# EAGLE design fact-atmega8 (EAGLE 6.3)
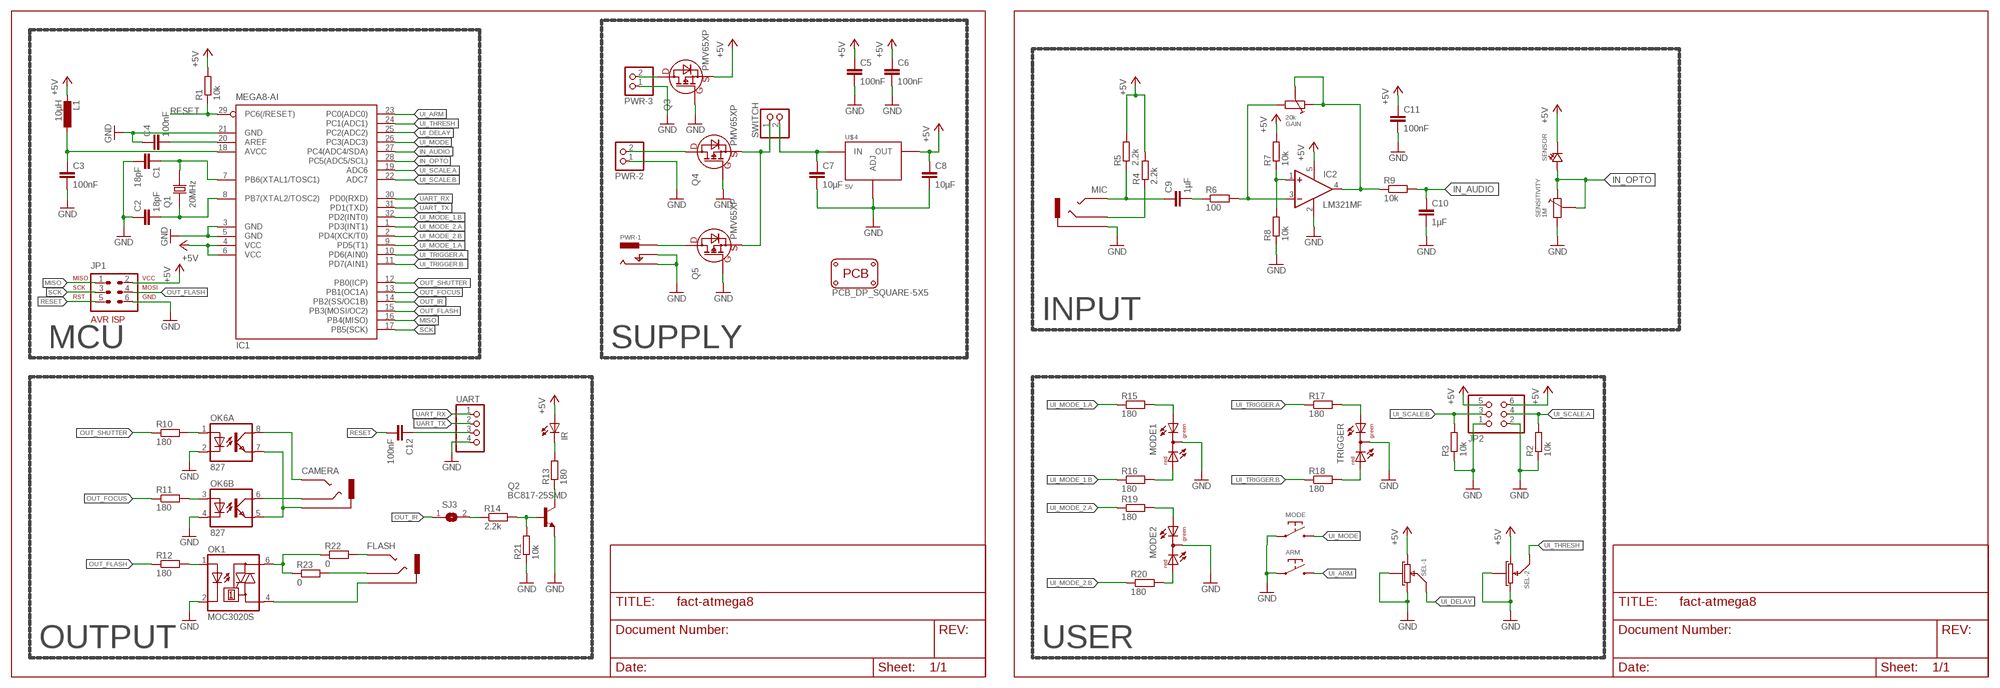
[diagram p0: schematic, sheet 1]

## Parts
ARM  SWITCH-DEFAULT_OFF  [SWITCH-GENERIC-4_PIN]
C1  18pF  C-EUC0603  [C0603]
C2  18pF  C-EUC0603  [C0603]
C3  100nF  C-EUC0603  [C0603]
C4  100nF  C-EUC0603  [C0603]
C5  100nF  C-EUC0603  [C0603]
C6  100nF  C-EUC0603  [C0603]
C7  10µF  C-EUC0603  [C0603]
C8  10µF  C-EUC0603  [C0603]
C9  1µF  C-EUC0603  [C0603]
C10  1µF  C-EUC0603  [C0603]
C11  100nF  C-EUC0603  [C0603]
C12  100nF  C-EUC0603  [C0603]
CAMERA  AUDIO-STEREO2MM5  [AUDIO-STEREO-2MM5-SJ1-2503A]
FLASH  AUDIO-STEREOCONRAD  [AUDIO-STEREO-CONRAD-KB3-3_PIN]
GAIN  20k  TRIM-POT  [TRIM-POT-CA6-VS5]
IC1  MEGA8-AI  [TQFP32-08]
IC2  LM321MF  [SOT23-5]
IR  LED5MM  [LED5MM]
JP1  AVR-ISP-6VERT  [AVR-ISP-6]
JP2  PINHD-2X3  [2X03]
L1  10µH  INDUCTOR0805  [R0805]
MIC  AUDIO-STEREOCONRAD-KB3  [AUDIO-STEREO-CONRAD-KB3-3_PIN]
MODE  SWITCH-DEFAULT_OFF  [SWITCH-GENERIC-4_PIN]
MODE1  DUOLED-RG-C  [DUOLED-C-5MM]
MODE2  DUOLED-RG-C  [DUOLED-C-5MM]
OK1  MOC3020S  MOC3032S  [DIL6-SMD]
OK6  827  OPTOCOUPLER-PC827SMD  [SMD08]
PCB1  PCB_DP_SQUARE-5X5  [DP5050_V1]
PWR-1  POWER-BARREL_JACKPJ-102A  [POWER-BARREL-2MM1-PJ_102A]
PWR-2  PINHD-1X2  [1X02]
PWR-3  PINHD-1X2  [1X02]
Q1  20MHz  CRYSTAL  [CRYSTAL-SMD-5MM_X_3.2MM]
Q2  BC817-25SMD  [SOT23-BEC]
Q3  PMV65XP  FET-P  [SOT23]
Q4  PMV65XP  FET-P  [SOT23]
Q5  PMV65XP  FET-P  [SOT23]
R1  10k  R-EU_R0603  [R0603]
R2  10k  R-EU_R0603  [R0603]
R3  10k  R-EU_R0603  [R0603]
R4  2.2k  R-EU_R0603  [R0603]
R5  2.2k  R-EU_R0603  [R0603]
R6  100  R-EU_R0603  [R0603]
R7  10k  R-EU_R0603  [R0603]
R8  10k  R-EU_R0603  [R0603]
R9  10k  R-EU_R0603  [R0603]
R10  180  R-EU_R0603  [R0603]
R11  180  R-EU_R0603  [R0603]
R12  180  R-EU_R0603  [R0603]
R13  180  R-EU_R0603  [R0603]
R14  2.2k  R-EU_R0603  [R0603]
R15  180  R-EU_R0603  [R0603]
R16  180  R-EU_R0603  [R0603]
R17  180  R-EU_R0603  [R0603]
R18  180  R-EU_R0603  [R0603]
R19  180  R-EU_R0603  [R0603]
R20  180  R-EU_R0603  [R0603]
R21  10k  R-EU_R0603  [R0603]
R22  0  R-EU_R1206  [R1206]
R23  0  R-EU_R1206  [R1206]
SEL  DUAL-POT  [POT-DUAL-P090]
SENSITIVITY  1M  TRIM-POT  [TRIM-POT-CA6-VS5]
SENSOR  PHOTODIODE  [LED-5MM]
SJ3  SJ  [SJ]
SWITCH  PINHD-1X2  [1X02]
TRIGGER  DUOLED-RG-C  [DUOLED-C-5MM]
U$4  5V  REGULATOR-TLV1117SOT223  [SOT223]
UART  PINHD-1X4  [1X04]

## Nets
+5V: C5.1 C6.1 C8.1 C11.1 IC1.4(VCC) IC1.6(VCC) IC2.5(V+) IR.A JP1.2 JP2.5 JP2.6 L1.2 Q3.P$2(SOURCE) R1.2 R4.2 R5.2 R7.2 SEL.P1-3(-1:B) SEL.P2-1(-2:A) SENSOR.K(C) U$4.2(OUT)
GND: ARM.P$1 ARM.P$2 C1.2 C2.1 C3.2 C4.1 C5.2 C6.2 C7.2 C8.2 C10.2 C11.2 IC1.3(GND) IC1.5(GND) IC1.21(GND) IC2.2(V-) JP1.6 JP2.1 JP2.2 MIC.2.1(SLEEVE) MIC.2.2(SLEEVE) MODE1.C MODE2.C MODE.P$1 MODE.P$2 OK1.2(C) OK6.2(A:C) OK6.4(B:C) PWR-1.P$2(OUTER) PWR-1.P$3(SWITCH) PWR-2.1 PWR-3.1 Q2.E Q3.P$1(GATE) Q4.P$1(GATE) Q5.P$1(GATE) R2.1 R3.1 R8.1 R21.1 SEL.CENTER(-1:SHIELD) SEL.G1-S(-1:SHIELD) SEL.G2-S(-2:SHIELD) SEL.P1-1(-1:A) SEL.P2-3(-2:B) SENSITIVITY.P$2 TRIGGER.C U$4.1(ADJ) U$4.4(ADJ) UART.4
HV_OUT: OK1.6(A2) R22.1 R23.1
HV_RING: FLASH.2.1(RING) FLASH.2.2(RING) R23.2
HV_SLEEVE: FLASH.1(SLEEVE) OK1.4(A1)
HV_TIP: FLASH.3(TIP) R22.2
IN_AUDIO: C10.1 IC1.27(PC4(ADC4/SDA)) R9.2
IN_OPTO: IC1.28(PC5(ADC5/SCL)) SENSITIVITY.CENTER SENSITIVITY.P$1 SENSOR.A
MISO: IC1.16(PB4(MISO)) JP1.1
N$1: R14.1 SJ3.2
N$2: C7.1 SWITCH.2 U$4.3(IN)
N$3: C3.1 IC1.18(AVCC) L1.1
N$4: C4.2 IC1.20(AREF)
N$5: PWR-1.P$1(CENTER) Q5.P$3(DRAIN)
N$7: C1.1 IC1.7(PB6(XTAL1/TOSC1)) Q1.P$2(C2)
N$8: C2.2 IC1.8(PB7(XTAL2/TOSC2)) Q1.P$1(C1)
N$9: PWR-2.2 Q4.P$3(DRAIN)
N$11: Q4.P$2(SOURCE) Q5.P$2(SOURCE) SWITCH.1
N$13: PWR-3.2 Q3.P$3(DRAIN)
N$15: CAMERA.P$1(SLEEVE) OK6.5(B:EMIT) OK6.7(A:EMIT)
N$16: CAMERA.P$4(RING) OK6.6(B:COL)
N$17: CAMERA.P$2(TIP) CAMERA.P$3(TIP) OK6.8(A:COL)
N$18: OK6.1(A:A) R10.2
N$19: MIC.1(RING) R4.1
N$20: C9.1 MIC.3(TIP) R5.1
N$21: IC2.1(+IN) R7.1 R8.2
N$22: C9.2 R6.1
N$23: GAIN.P$2 IC2.3(-IN) R6.2
N$24: GAIN.CENTER GAIN.P$1 IC2.4(OUT) R9.1
N$25: OK1.1(A) R12.2
N$26: OK6.3(B:A) R11.2
N$27: Q2.C R13.1
N$28: IR.K(C) R13.2
N$29: Q2.B R14.2 R21.2
N$30: MODE1.AX(AG) R15.2
N$31: MODE1.AR R16.2
N$32: R17.2 TRIGGER.AX(AG)
N$33: R18.2 TRIGGER.AR
N$35: C12.1 UART.3
N$37: MODE2.AX(AG) R19.2
N$38: MODE2.AR R20.2
OUT_FLASH: IC1.15(PB3(MOSI/OC2)) JP1.4 R12.1
OUT_FOCUS: IC1.13(PB1(OC1A)) R11.1
OUT_IR: IC1.14(PB2(SS/OC1B)) SJ3.1
OUT_SHUTTER: IC1.12(PB0(ICP)) R10.1
RESET: C12.2 IC1.29(PC6(/RESET)) JP1.5 R1.1
SCK: IC1.17(PB5(SCK)) JP1.3
UART_RX: IC1.30(PD0(RXD)) UART.1
UART_TX: IC1.31(PD1(TXD)) UART.2
UI_ARM: ARM.P$3 ARM.P$4 IC1.23(PC0(ADC0))
UI_DELAY: IC1.25(PC2(ADC2)) SEL.P1-2(-1:M)
UI_MODE: IC1.26(PC3(ADC3)) MODE.P$3 MODE.P$4
UI_MODE_1.A: IC1.9(PD5(T1)) R15.1
UI_MODE_1.B: IC1.32(PD2(INT0)) R16.1
UI_MODE_2.A: IC1.1(PD3(INT1)) R19.1
UI_MODE_2.B: IC1.2(PD4(XCK/T0)) R20.1
UI_SCALE.A: IC1.19(ADC6) JP2.4 R2.2
UI_SCALE.B: IC1.22(ADC7) JP2.3 R3.2
UI_THRESH: IC1.24(PC1(ADC1)) SEL.P2-2(-2:M)
UI_TRIGGER.A: IC1.10(PD6(AIN0)) R17.1
UI_TRIGGER.B: IC1.11(PD7(AIN1)) R18.1

## Notes on the sheet
- INPUT
- MCU | SUPPLY
- OUTPUT | USER

## Library data of the parts
ARM MODE = p.peter-passives:SWITCH-DEFAULT_OFF
C1-C12 = p.peter-rcl:C-EU: CAPACITOR, European symbol
CAMERA = p.peter-connectors:AUDIO-STEREO: Conrad 3.5mm Stereo 0.66EUR Best.-Nr.: 733962 - 62; OC_DIGIKEY: CP1-2503A-ND
FLASH MIC = p.peter-connectors:AUDIO-STEREO: Conrad 3.5mm Stereo 0.66EUR Best.-Nr.: 733962 - 62; OC_CONRAD: 733962 - 62
GAIN SENSITIVITY = p.peter-passives:TRIM-POT
IC1 = atmel:MEGA8: MICROCONTROLLER 8 Kbytes FLASH, 1 kbytes SRAM, 512 bytes EEPROM, USART, 6-channel 10 bit ADC, 2-channel 8 bit ADC Pin compatible with Atmega48, ATMega88, ATMega168 Source: avr.lbr; MPN: ATMEGA8-16AU; OC_FARNELL: 9171371; OC_NEWARK: 73M8863
IC2 = linear:LM321?*: Low Power Single Op Amp Source: http://cache.national.com/ds/LM/LM321.pdf
IR = led:LED: LED OSRAM: - CHIPLED LG R971, LG N971, LY N971, LG Q971, LY Q971, LO R971, LY R971 LH N974, LH R974 LS Q976, LO Q976, LY Q976 LO Q996 - Hyper CHIPLED LW Q18S LB Q993, LB Q99A, LB R99A - SideLED LS A670, LO A670, LY A670, LG A670, LP A670 LB A673, LV A673, LT A673, LW A673 LH A674 LY A675 LS A676, LA A676, LO A676, LY A676, LW A676 LS A679, LY A679, LG A679 - Hyper Micro SIDELED® LS Y876, LA Y876, LO Y876, LY Y876 LT Y87S - SmartLED LW L88C, LW L88S LB L89C, LB L89S, LG L890 LS L89K, LO L89K, LY L89K LS L896, LA L896, LO L896, LY L896 - TOPLED LS T670, LO T670, LY T670, LG T670, LP T670 LSG T670, LSP T670, LSY T670, LOP T670, LYG T670 LG T671, LOG T671, LSG T671 LB T673, LV T673, LT T673, LW T673 LH T674 LS T676, LA T676, LO T676, LY T676, LB T676, LH T676, LSB T676, LW T676 LB T67C, LV T67C, LT T67C, LS T67K, LO T67K, LY T67K, LW E67C LS E67B, LA E67B, LO E67B, LY E67B, LB E67C, LV E67C, LT E67C LW T67C LS T679, LY T679, LG T679 LS T770, LO T770, LY T770, LG T770, LP T770 LB T773, LV T773, LT T773, LW T773 LH T774 LS E675, LA E675, LY E675, LS T675 LS T776, LA T776, LO T776, LY T776, LB T776 LHGB T686 LT T68C, LB T68C - Hyper Mini TOPLED® LB M676 - Mini TOPLED Santana® LG M470 LS M47K, LO M47K, LY M47K Source: http://www.osram.convergy.de LUXEON: - LUMILED® LXK2-PW12-R00, LXK2-PW12-S00, LXK2-PW14-U00, LXK2-PW14-V00 LXK2-PM12-R00, LXK2-PM12-S00, LXK2-PM14-U00 LXK2-PE12-Q00, LXK2-PE12-R00, LXK2-PE12-S00, LXK2-PE14-T00, LXK2-PE14-U00 LXK2-PB12-K00, LXK2-PB12-L00, LXK2-PB12-M00, LXK2-PB14-N00, LXK2-PB14-P00, LXK2-PB14-Q00 LXK2-PR12-L00, LXK2-PR12-M00, LXK2-PR14-Q00, LXK2-PR14-R00 LXK2-PD12-Q00, LXK2-PD12-R00, LXK2-PD12-S00 LXK2-PH12-R00, LXK2-PH12-S00 LXK2-PL12-P00, LXK2-PL12-Q00, LXK2-PL12-R00 Source: www.luxeon.com KINGBRIGHT: KA-3528ASYC Source: www.kingbright.com
JP1 = avr:AVR-ISP-6: AVR ISP-6 Serial Programming Header
JP2 = pinhead:PINHD-2X3: PIN HEADER
L1 = p.peter-passives:INDUCTOR
MODE1 MODE2 TRIGGER = led:DUOLED-RG-C: DUO LED 2 colors (red/green), 5 mm, round, common Cathode www.ligitek.com or other producers.; OC_DIGIKEY: WP59EGC
OK1 = optocoupler:MOC30*: 6-Pin DIP Zero-Cross Optoisolators Triac Driver Output (250/400 Volt Peak) Source: http://www.fairchildsemi.com/ds/MO/MOC3043-M.pdf; MF: FAIRCHILD SEMICONDUCTOR; MPN: MOC3032S-M; OC_FARNELL: unknown; OC_NEWARK: 05C2871
OK6 = p.peter-ics:OPTOCOUPLER-PC827: SHARP OPTO COUPLER
PCB1 = dp_pcb:PCB_DP_SQUARE: Dangerous Prototypes Standard Square PCB sizes
PWR-1 = p.peter-connectors:POWER-BARREL_JACK
PWR-2 PWR-3 SWITCH = pinhead:PINHD-1X2: PIN HEADER
Q1 = p.peter-ics:CRYSTAL; OC_DIGIKEY: 7A-16.000MAAJ-T
Q2 = transistor-npn:BC817*: NPN Transistor; OC_DIGIKEY: BC817-25LT3GOSCT-ND
Q3-Q5 = p.peter-ics:FET-P
R1-R21 = p.peter-rcl:R-EU_: RESISTOR, European symbol
R22 R23 = rcl:R-EU_: RESISTOR, European symbol
SEL = p.peter-passives:DUAL-POT
SENSOR = p.peter-leds:PHOTODIODE
SJ3 = jumper:SJ: SMD solder JUMPER
U$4 = p.peter-regulators:REGULATOR-TLV1117
UART = pinhead:PINHD-1X4: PIN HEADER

## Board
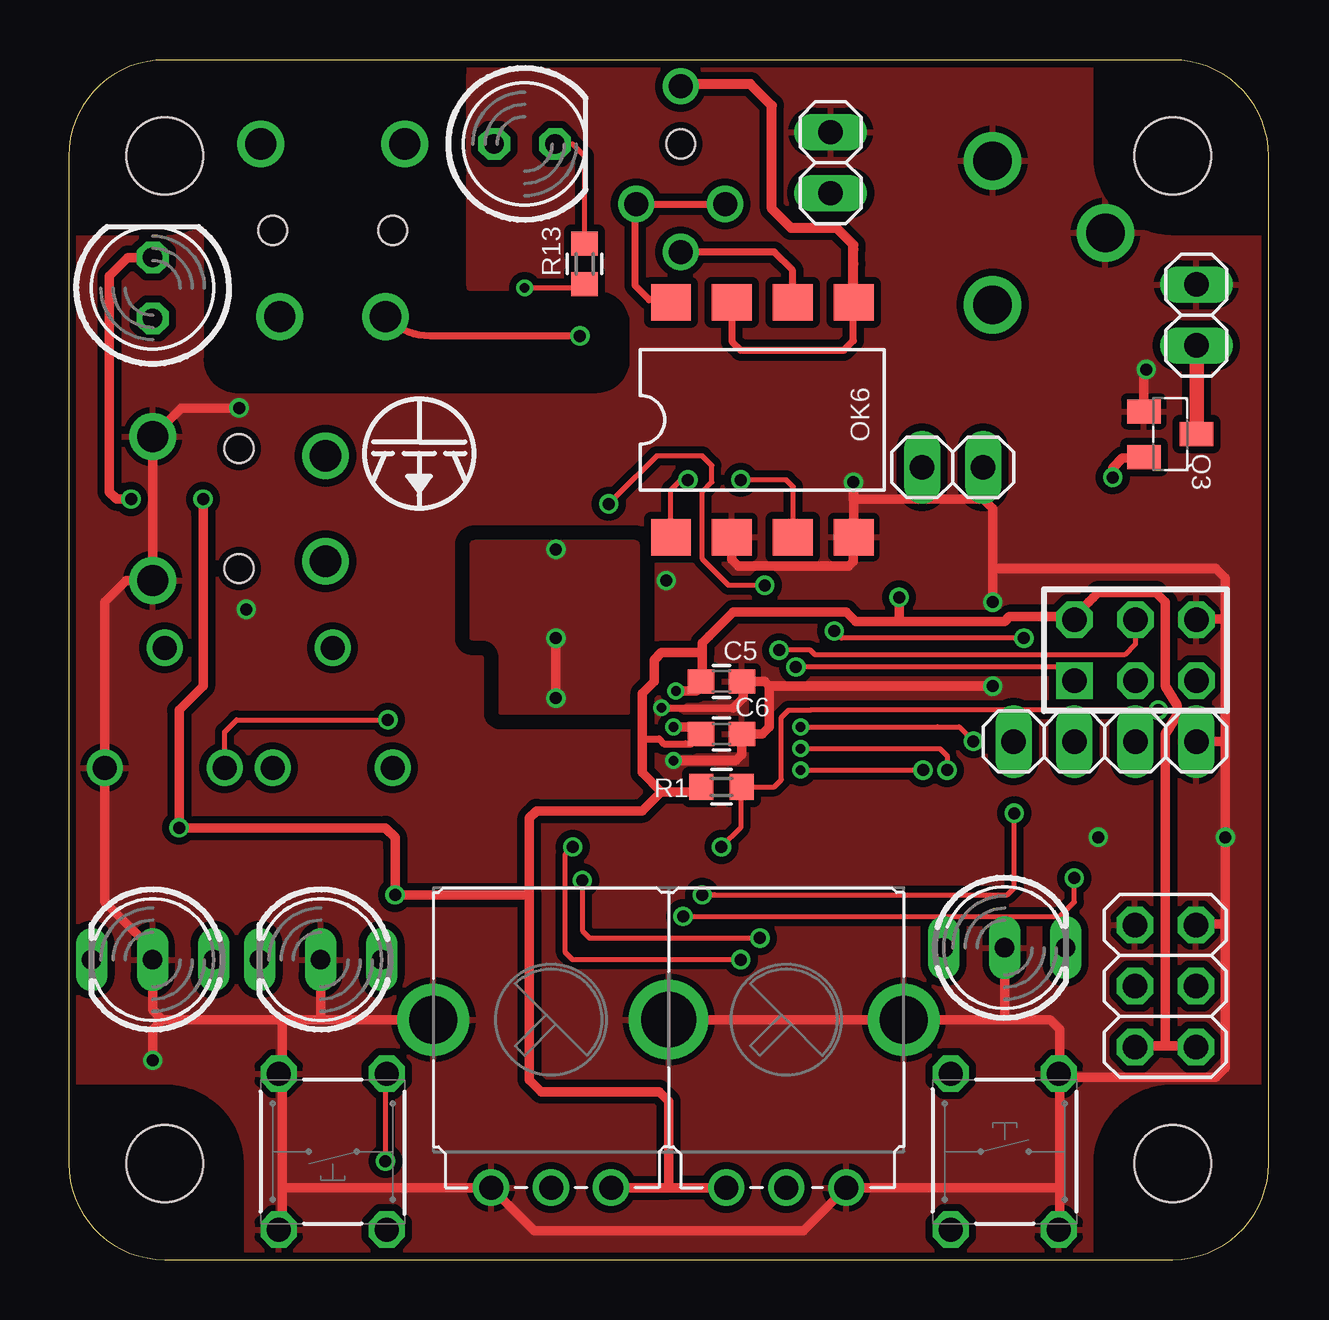
[diagram p1: board, top side]
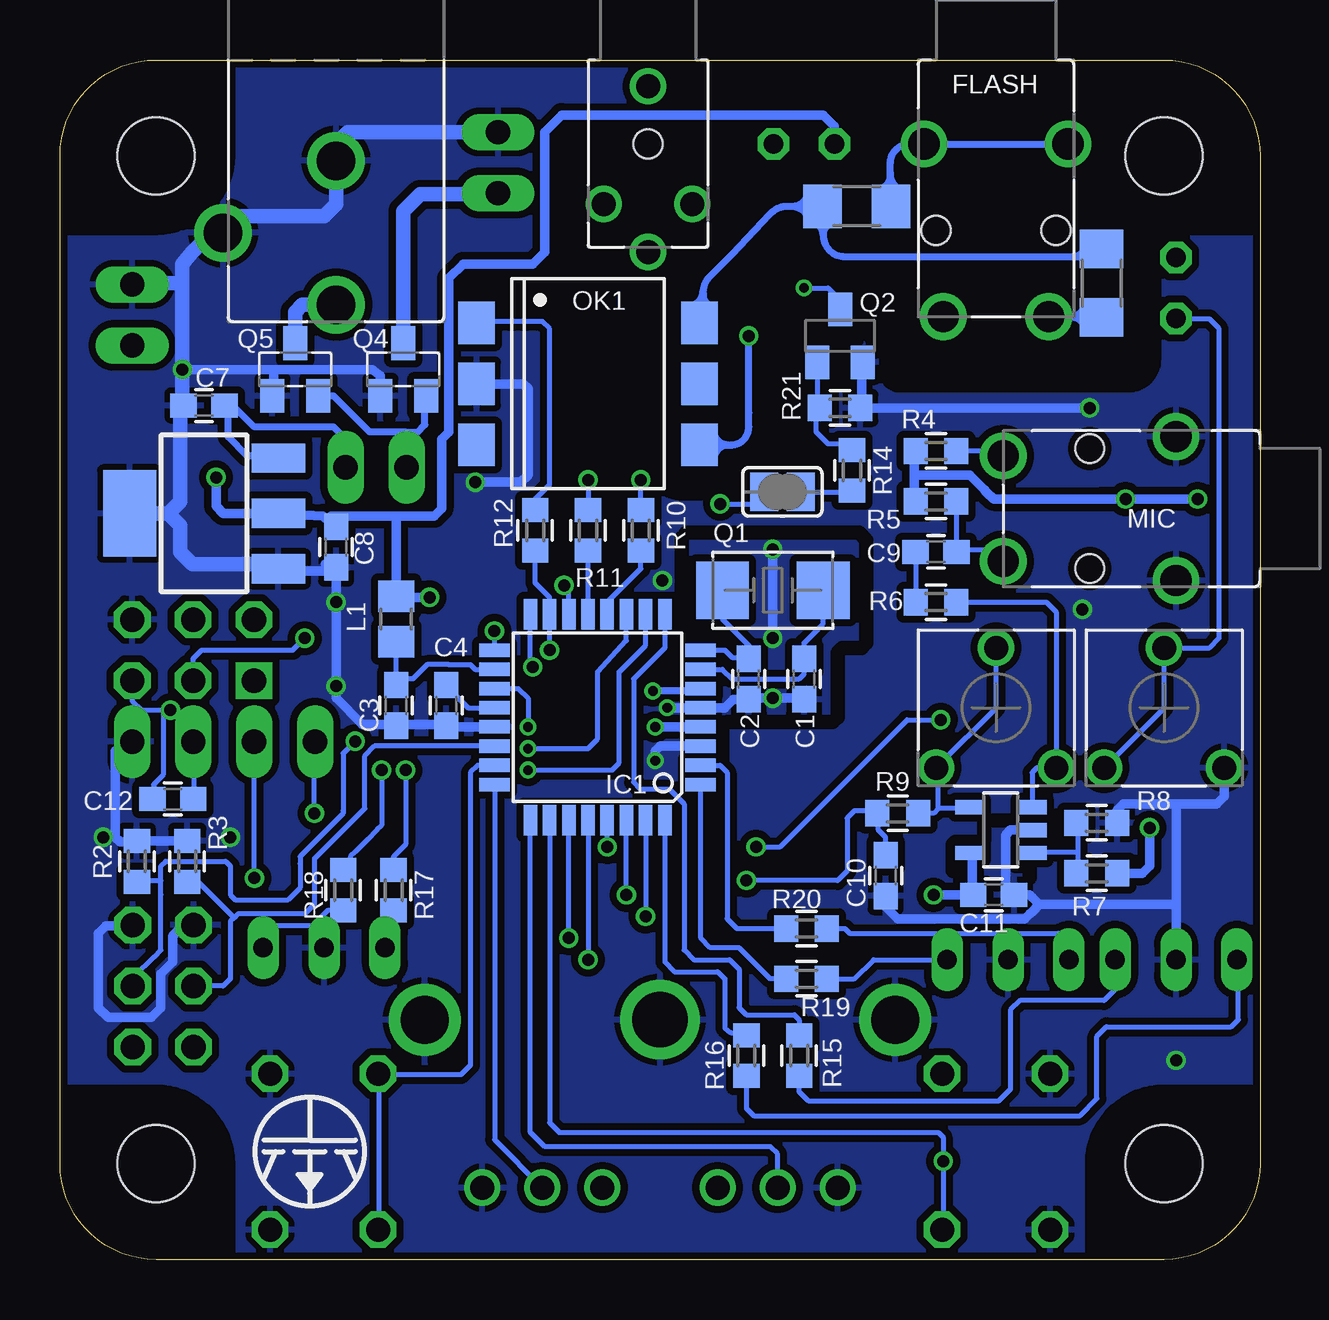
[diagram p2: board, bottom side, seen from below]

Size 50 x 50 mm. Coordinates in mm from the lower left corner, seen from the top.
Copper layers (1*16): Top 0.035mm / dielectric 1.5mm / Bottom 0.035mm
Design rules "Fusion_eagle_rule_v1.1 *": minimum track width 6mil, minimum drill 12mil, track to track 6mil, track to pad 6mil, pad to pad 6mil, via to via 6mil, smd to smd 0mil, copper to edge 10mil, drill to drill 10mil, minimum pad ring 10mil, minimum via ring 6mil, stop-mask expansion 2mil, vias tented up to drill 100mil, thermal gap 10mil
tRestrict: 48 lines
bRestrict: 64 lines

### Footprints (pad centres in the part's own frame; a part is rotated, then mirrored left to right if it is on the bottom)
SWITCH-GENERIC-4_PIN = drill 1 octagon: P$1 2.25,3.25; P$2 2.25,-3.25; P$3 -2.25,3.25; P$4 -2.25,-3.25
C0603 = smd 1.1 x 1: 1 -0.85,0; 2 0.85,0
AUDIO-STEREO-2MM5-SJ1-2503A = drill 1: P$1 -2.4,0; P$2 2.5,-1.85; P$3 2.5,1.85; P$4 4.5,0 | hole 1.2: 0,0
AUDIO-STEREO-CONRAD-KB3-3_PIN = drill 1.3: 1 7.2,-2.2; 2.1 0,3; 2.2 0,-3; 3 7.2,2.2 | hole 1.2: 3.6,2.5; 3.6,-2.5
TRIM-POT-CA6-VS5 = drill 1: CENTER 0,2.5; P$1 -2.5,-2.5; P$2 2.5,-2.5
TQFP32-08 = smd 1.27 x 0.559: 1 -4.293,2.8; 2 -4.293,2; 3 -4.293,1.2; 4 -4.293,0.4; 5 -4.293,-0.4; 6 -4.293,-1.2; 7 -4.293,-2; 8 -4.293,-2.8; 17 4.293,-2.8; 18 4.293,-2; 19 4.293,-1.2; 20 4.293,-0.4; 21 4.293,0.4; 22 4.293,1.2; 23 4.293,2; 24 4.293,2.8 | smd 0.559 x 1.27: 9 -2.8,-4.293; 10 -2,-4.293; 11 -1.2,-4.293; 12 -0.4,-4.293; 13 0.4,-4.293; 14 1.2,-4.293; 15 2,-4.293; 16 2.8,-4.293; 25 2.8,4.293; 26 2,4.293; 27 1.2,4.293; 28 0.4,4.293; 29 -0.4,4.293; 30 -1.2,4.293; 31 -2,4.293; 32 -2.8,4.293
SOT23-5 = smd 0.6 x 1.2: 1 -0.95,-1.306; 2 0,-1.306; 3 0.95,-1.306; 4 0.95,1.306; 5 -0.95,1.306
LED5MM = drill 0.813 octagon: A -1.27,0; K 1.27,0
AVR-ISP-6 = drill 1.016 square: 1 -2.54,-1.27 | drill 1.016 octagon: 2 -2.54,1.27; 3 0,-1.27; 4 0,1.27; 5 2.54,-1.27; 6 2.54,1.27
2X03 = drill 1.016 octagon: 1 -2.54,-1.27; 2 -2.54,1.27; 3 0,-1.27; 4 0,1.27; 5 2.54,-1.27; 6 2.54,1.27
R0805 = smd 1.3 x 1.5: 1 -0.95,0; 2 0.95,0
DUOLED-C-5MM = drill 0.813 long: AR 2.54,0; AX -2.54,0; C 0,0
DIL6-SMD = smd 1.78 x 1.52: 1 -2.54,-4.645; 2 0,-4.645; 3 2.54,-4.645; 4 2.54,4.645; 5 0,4.645; 6 -2.54,4.645
SMD08 = smd 1.651 x 1.524: 1 -3.81,-4.889; 2 -1.27,-4.889; 3 1.27,-4.889; 4 3.81,-4.889; 5 3.81,4.889; 6 1.27,4.889; 7 -1.27,4.889; 8 -3.81,4.889
DP5050_V1 = hole 3.2: 4,4; 46,4; 46,46; 4,46
POWER-BARREL-2MM1-PJ_102A = drill 1.6: P$1 3,0; P$2 -3,0; P$3 0,-4.7
1X02 = drill 1.016 long: 1 -1.27,0; 2 1.27,0
CRYSTAL-SMD-5MM_X_3.2MM = smd 2.2 x 2.4: P$1 -2.1,0; P$2 2.1,0
SOT23-BEC = smd 1 x 1.4: B -0.95,-1.1; C 0,1.1; E 0.95,-1.1
SOT23 = smd 1 x 1.4: P$1 0.95,1.1; P$2 -0.95,1.1; P$3 0,-1.1
R0603 = smd 1 x 1.1: 1 -0.85,0; 2 0.85,0
R1206 = smd 1.6 x 1.803: 1 -1.422,0; 2 1.422,0
POT-DUAL-P090 = drill 2.3: CENTER 0,0 | drill 2: G1-S -9.8,0; G2-S 9.8,0 | drill 1: P1-1 -7.4,-7; P1-2 -4.9,-7; P1-3 -2.4,-7; P2-1 2.4,-7; P2-2 4.9,-7; P2-3 7.4,-7
LED-5MM = drill 0.813 octagon: A -1.27,0; K 1.27,0
SJ = smd 1.168 x 1.6: 1 -0.762,0; 2 0.762,0
SOT223 = smd 1.219 x 2.235: 1 -2.311,-3.099; 2 0,-3.099; 3 2.311,-3.099 | smd 3.6 x 2.2: 4 0,3.099
1X04 = drill 1.016 long: 1 -3.81,0; 2 -1.27,0; 3 1.27,0; 4 3.81,0

### Placement (x,y rotation side)
ARM  39,4.5 0 top
C1  19,24.2 270 bottom
C2  21.3,24.2 90 bottom
C3  36,23.1 270 bottom
C4  33.9,23.1 90 bottom
C5  27.2,24.1 0 top
C6  27.2,21.9 0 top
C7  44,35.6 180 bottom
C8  38.5,29.7 270 bottom
C9  13.5,29.5 180 bottom
C10  15.6,16 270 bottom
C11  11.1,15.2 0 bottom
C12  45.3,19.2 180 bottom
CAMERA  25.5,46.5 270 bottom
FLASH  11,46.5 270 bottom
GAIN  11,23 0 bottom
IC1  27.6,22.6 180 bottom
IC2  10.8,17.9 90 bottom
IR  19,46.5 0 top
JP1  44.45,25.4 0 top
JP2  45.7,11.4 270 top
L1  36,26.7 90 bottom
MIC  3.5,31.3 180 bottom
MODE  11,4.5 180 top
MODE1  3.5,12.5 180 top
MODE2  10.5,12.5 180 top
OK1  28,36.5 270 bottom
OK6  28.9,35 0 top
PCB1  0,0 0 top
PWR-1  38.5,42.8 270 bottom
PWR-2  31.75,45.72 270 top
PWR-3  46.99,39.37 270 top
Q1  20.3,27.9 0 bottom
Q2  17.5,38.5 0 bottom
Q3  45.9,34.4 90 top
Q4  35.7,37.1 180 bottom
Q5  40.2,37.1 180 bottom
R1  27.2,19.7 180 top
R2  46.8,16.6 270 bottom
R3  44.7,16.6 270 bottom
R4  13.5,33.7 180 bottom
R5  13.5,31.6 180 bottom
R6  13.5,27.4 0 bottom
R7  6.8,16.1 0 bottom
R8  6.8,18.2 180 bottom
R9  15.1,18.6 180 bottom
R10  25.8,30.4 90 bottom
R11  28,30.4 90 bottom
R12  30.2,30.4 90 bottom
R13  21.5,41.5 90 top
R14  17,32.9 90 bottom
R15  19.2,8.5 270 bottom
R16  21.4,8.5 270 bottom
R17  36.1,15.4 270 bottom
R18  38.2,15.4 270 bottom
R19  18.9,11.7 0 bottom
R20  18.9,13.8 0 bottom
R21  17.5,35.5 180 bottom
R22  6.6,40.7 270 bottom
R23  16.8,43.9 0 bottom
SEL  25,10 0 top
SENSITIVITY  4,23 0 bottom
SENSOR  3.5,40.5 90 top
SJ3  19.9,32 0 bottom
SWITCH  36.83,33.02 0 top
TRIGGER  39,13 0 top
U$1  [LOGO-JUSTGEEK-XS]  14.6,33.6 0 top
U$2  [LOGO-JUSTGEEK-XS]  39.6,4.5 0 bottom
U$4  44,31.1 90 bottom
UART  43.18,21.59 0 top

### Tracks (layer width: path | path; a pad name or v marks a point on that pad's centre or on a via)
+5V  (via drill 0.4, 0.5)
  Top 0.2: 25,3 SEL.P2-1 | 23.9,22.1 23.9,21.7
  Top 0.3: 23.9,21.7 24.6,21.7 24.8,21.5 25.7,21.5 25.95,21.5 C6.1
  Top 0.4: C6.1 25.95,22.2 25.6,22.2 v25.2,22.2 | 26.4,25.3 26.4,24.1 C5.1 26.15,23.7 v25.3,23.7 | 26.4,25.3 26.4,25.7 26.7,26 27.7,27 32.4,27 32.8,26.6 34.6,26.6 | 41.9,26.7 41.93,26.67 JP1.2 41.91,26.69 41.9,26.7 | 41.9,26.7 41.8,26.8 39.2,26.8 39,26.6 34.6,26.6 | SEL.P1-3 25,3 | R1.2 26.4,19.7 26.2,19.5 24.7,19.5 | 24.7,19.5 23.9,20.3 23.9,21.7 23.9,22.1 23.9,23.6 24.4,24.1 24.4,25 24.7,25.3 26.4,25.3 | SEL.P2-1 25,3 | 25,3 25,6.6 24.6,7 19.7,7 19.2,7.5 19.2,14.8 19.2,15.2 | 19.2,15.2 v13.6,15.2 13.6,17.2 13.6,17.6 13.2,18 v4.6,18 4.6,22.9 5.6,23.9 5.6,31.1 v5.6,31.7 | v43.5,32.6 43.5,33 43.9,33.4 44.4,33.4 44.75,33.4 Q3.P$2 | v34.6,27.6 34.6,26.6 | 41.9,26.7 41.9,26.8 42.5,27.4 42.7,27.6 42.9,27.8 45.3,27.8 45.7,27.4 45.7,23.9 46.2,23.1 46.2,22.7 45.7,21.9 45.7,13.8 45.7,11 45.7,8.9 | 45.7,8.9 44.43,8.9 JP2.5 | 45.7,8.9 46.97,8.9 JP2.6 | 19.2,15.2 19.2,18.4 19.5,18.7 23.9,18.7 24.7,19.5 | SENSOR.K 2.47,41.77 1.7,41 1.7,32 2,31.7 v2.6,31.7
  Bottom 0.2: C11.1 12,15.2 | 14.4,31.9 14.4,32.7
  Bottom 0.3: 23.41,23.7 v25.3,23.7 | U$4.2 41,31 U$4.2
  Bottom 0.4: U$4.2 40,31 | 41,31 U$4.2 | U$4.2 39.05,31 C8.1 38.65,30.65 38.5,30.5 38.5,30.8 38.7,31 37.3,31 36.1,31 36,31 | 36,31 36,30.8 36,27.7 L1.2 35.95,27.6 v34.6,27.6 | IC1.4 v25.2,22.2 | IC1.6 23.41,23.7 | IR.A 17.73,47.23 18.2,47.7 22.2,47.7 22.6,47.7 29.1,47.7 29.8,47 29.8,44.6 29.8,42 30.3,41.5 33.2,41.5 33.8,40.9 33.8,36.3 33.8,34.5 34.1,34.2 34.1,31.5 34.1,31.3 34.4,31 35.9,31 36,31 | 12,15.2 12,16.84 IC2.5 | C11.1 v13.6,15.2 | R7.2 4.9,16.1 4.6,16.4 v4.6,18 | 14.4,31.9 14.35,31.85 R5.2 14.4,31.8 14.4,32.7 | 14.4,32.7 14.4,33.8 14.4,33.95 R4.2 | U$4.2 43.2,31.1 43.5,31.4 v43.5,32.6 | 14.4,32.7 12.1,32.7 11.5,32.1 11.4,32 11.1,31.7 6.6,31.7 | 6.6,31.7 v5.6,31.7 | v2.6,31.7 v5.6,31.7 | v5.6,31.7 6.6,31.7
GND  (via drill 0.4, 0.5)
  Top 0.2: 9.6,10 8.9,10 9.5,10 | C6.2 28.05,21.95
  Top 0.3: v24.7,23 27.7,23
  Top 0.4: C6.2 28.05,21.05 27.8,20.8 v25.2,20.8 | C5.2 28.1,24.1 | 28.1,24.1 28.7,24.1 29,24.1 29.2,23.9 | v38.5,23.9 38.4,23.9 29.6,23.9 29.4,23.9 29.2,23.9 | 48.2,26.7 48.2,21.8 48.2,21.6 | 8.9,2.8 8.9,1.3 8.85,1.25 MODE.P$1 | 8.9,2.8 8.9,7.8 | 8.9,2.8 8.9,3 SEL.P1-1 19.4,1.2 30.6,1.2 SEL.P2-3 36.7,3 41.3,3 | 41.3,3 41.3,1.3 ARM.P$2 | 41.3,3 41.3,7.6 | 41.3,7.6 41.3,7.7 | 41.3,7.6 41.3,7.7 | 48.2,21.6 48.2,14 | 48.2,14 48.2,9.3 48.2,8 47.8,7.6 41.3,7.6 | 48.2,21.6 48.09,21.59 UART.4 | 39.1,10 SEL.G2-S SEL.CENTER | 39.1,10 40.9,10 41.3,9.6 41.3,7.7 | TRIGGER.C 39,10.1 39.1,10 | SEL.G1-S 10.5,10 | 10.5,10 9.6,10 | 8.9,10 8.9,9.5 8.9,7.8 | MODE2.C 10.5,10 | 3.9,10 3.5,10.4 MODE1.C 3.5,12.9 1.5,14.9 SENSITIVITY.P$2 1.5,27.4 2.4,28.3 MIC.2.1 MIC.2.2 4.7,35.5 v7.1,35.5 | 3.9,10 8.9,10 | 9.5,10 8.9,10 | 8.9,7.8 8.8,7.8 MODE.P$2 | 41.3,7.7 ARM.P$1 | OK6.2 27.63,29.17 27.9,28.9 32.5,28.9 32.7,29.1 32.7,29.6 OK6.4 32.71,32.19 v32.7,32.4 32.7,31.7 38.1,31.7 38.5,31.3 38.5,28.8 | 38.5,28.8 46.8,28.8 47.8,28.8 48.2,28.4 48.2,26.7 | 38.5,28.8 v38.5,27.4 | v20.3,25.9 v20.3,23.4 | Q3.P$1 44.8,36.9 v44.9,37.1 | JP1.6 46.99,26.69 47,26.7 48.2,26.7 | v3.5,8.3 3.5,9.6 3.9,10 | 27.7,23 28.1,23.4 28.1,24.1 | 28.05,21.95 28.1,21.9 28.9,21.9 29.2,22.2 29.2,23.5 29.2,23.9 | JP2.2 46.97,13.97 47,14 48.2,14
  Bottom 0.2: 16.55,35.6 R21.1 16.65,35.55 16.7,35.6
  Bottom 0.3: 44.9,40.7 44.9,41.5
  Bottom 0.4: 41.5,29 41.21,29 U$4.1 | C7.2 45,35.5 44.9,36.2 | U$4.1 40.9,28.9 41,29 40.5,29 | PWR-3.1 47,40.7 | C1.2 19,23.4 v20.3,23.4 21.25,23.4 C2.1 21.95,23.35 22.3,23 IC1.5 23.41,23 v24.7,23 | IC1.21 33.9,22.2 C4.1 33.95,22.3 36,22.3 C3.2 36.05,22.3 37.4,22.3 38.5,23.4 v38.5,23.9 v38.5,27.4 C8.2 38.95,29 38.75,28.8 38.6,28.8 38.7,28.7 40.6,28.7 40.89,28.7 U$4.1 | OK1.2 30.7,36.5 30.5,36.3 30.5,32.7 30.8,32.4 v32.7,32.4 | IC2.2 10.4,17.9 10.6,17.7 10.6,15.2 C11.2 9.6,15.2 9.5,15.1 9.2,14.8 | 3.5,14.8 3.5,14.3 MODE1.C | R8.1 5.95,18.75 5.7,19 3.5,19 | 3.5,19 3.5,14.8 | SENSITIVITY.P$2 1.5,19.3 1.8,19 3.5,19 | C10.2 15.6,14.7 15.1,14.2 14.75,14.2 9.8,14.2 9.6,14.4 9.5,14.5 9.2,14.8 | 3.5,14.8 9.2,14.8 | v20.3,29.6 v20.3,25.9 | 38.5,46 PWR-1.P$2 | 41.1,37.1 41,37.1 37,37.1 36.65,36.85 Q4.P$1 | C7.2 Q3.P$1 | 41.1,37.1 v44.9,37.1 44.8,36.7 44.8,35.4 44.85,35.4 C7.2 | Q5.P$1 41.1,36 41.1,37.1 | IC1.3 24.7,21.4 25,21.4 25.2,21.2 v25.2,20.8 | R3.1 R2.1 46.85,17.45 46.9,17.4 47.5,17.4 47.7,17.6 47.7,21.2 47.3,21.6 UART.4 | JP2.2 47.01,13.9 47.3,13.9 48.1,13.9 48.4,13.6 48.4,10.5 48,10.1 46.2,10.1 45.8,10.5 45.8,11.9 45.3,12.4 45.3,13.5 44.9,13.9 44.5,13.9 | Q2.E 16.6,37.4 16.6,35.6 | 16.6,35.6 16.6,35.55 R21.1 16.65,35.55 16.6,35.6 | 16.6,35.6 16.5,35.5 v7.1,35.5
  Bottom 0.6: U$4.4 45.5,31.1 | 45.5,31.1 45,30.6 45,29.5 44.5,29 41.5,29 | 45,35.5 45,31.6 45.5,31.1 | PWR-1.P$2 38.5,44 39,43.5 42.5,43.5 43,43 PWR-1.P$3 43.5,42.5 44,42.5 44.5,42 44.9,41.5 44.9,40.7 | 44.9,36.2 44.9,40.7 | 47,40.7 44.9,40.7 | PWR-2.1 38.01,46.99 38.5,46.5 38.5,46
  other vias: 7.4,27.1 24.9,28.3 42.9,17.6 48.2,17.6
  pour Bottom (isolate 0.3): 0,0 0,50 51.72,51.76 50,0
  pour Top (isolate 0.3): 0,0 0,50 50.74,50.75 50,0
HV_OUT
  Bottom 0.3: R22.1 6.92,41.8 7.9,41.8 | 18.2,42.7 18.2,43.9 R23.1 19.5,43.9 | 18.2,42.7 arc-90 17.3,41.8 8,41.8 | 8,41.8 7.9,41.8 | 7.9,41.8 7.8,41.8 arc-90 7.3,42.3 | 8,41.8 7.6,41.8 arc90 7.3,41.5 | 18.2,42.7 arc90 17.7,43.2 17.6,43.2 | 18.2,42.7 arc-90 18.7,43.2 18.8,43.2 arc-90 19.5,43.9 | OK1.6 23.34,39.04 arc90 23.3,39 23.3,39.1 arc19 23.2,39.7 | 23.2,39.7 23.2,40.3 | 19.5,43.9 19.6,43.9 arc-51 20.4,43.6 22,41.9 22.9,41 arc-46 23.2,40.3 | 23.2,40.3 23.2,40.1 | 23.9,39.7 23.8,39.7 23.3,39.7 | 23.3,39.7 23.2,39.7 | 22.75,39.75 arc90 23.2,40.2 23.2,40.4 arc90 23.85,39.75 | 23.95,39.75 23.85,39.75 | 23.85,39.75 23.35,39.75 arc90 23.3,39.7 | 19.5,43.9 arc-90 18.8,44.6
HV_RING
  Bottom 0.3: FLASH.2.1 FLASH.2.2 14.6,46.5 arc-90 15.4,45.7 15.4,45.3 | R23.2 15.4,43.9 15.4,45.3 | 15.4,45.3 15.4,45.2 | 15.4,45.2 arc-90 14.8,44.6 | 15.4,45.3 15.4,45.2 | 15.4,45.2 arc90 16,44.6
HV_SLEEVE  (via drill 0.5)
  Top 0.3: v21.3,38.5 16.25,38.5 15.05,38.5 arc-47 FLASH.1
  Bottom 0.3: v21.3,38.5 21.3,35.3 21.3,34.7 arc90 22.05,33.95 22.15,33.95 | OK1.4 OK1.4 arc-90 OK1.4 22.15,33.95 | 22.15,33.95 arc90 22.75,34.55 22.75,34.7 | 22.15,33.95 arc-90 22.75,33.35 22.75,33.25
  Bottom 0.4: 23.46,33.96 OK1.4 23.41,34
HV_TIP
  Bottom 0.3: FLASH.3 8,39.3 | 8,39.3 7.9,39.3 | 7.9,39.3 6.62,39.3 arc90 R22.2 | 7.9,39.3 arc-90 7.3,39.9 | 8,39.3 7.9,39.3 | 7.9,39.3 arc90 7.3,38.7
IN_AUDIO  (via drill 0.5)
  Top 0.2: v21.4,15.8 21.4,15.7 21.4,13.7 21.7,13.4 v28.8,13.4
  Bottom 0.2: C10.1 15.75,16.85 15.6,16.8 15.6,17.6 15.9,17.9 15.9,18.55 R9.2 16,18.6 16.1,18.7 16.9,18.7 17.2,18.4 17.2,16.2 17.6,15.8 v21.4,15.8 | v28.8,13.4 IC1.27
IN_OPTO  (via drill 0.5)
  Top 0.2: SENSITIVITY.P$1 6.5,22 7,22.5 v13.3,22.5 | v28,12.5 21,12.5 20.7,12.8 20.7,16.9 v21,17.2
  Bottom 0.2: SENSITIVITY.P$1 4,23 SENSITIVITY.CENTER 2.1,25.5 1.7,25.9 1.7,38.8 2.1,39.2 3.47,39.2 SENSOR.A | IC1.28 28,18.11 v28,12.5 | v21,17.2 20,17.2 14.7,22.5 v13.3,22.5
MISO  (via drill 0.5)
  Top 0.2: JP1.1 41.91,24.11 41.9,24.1 41.9,24.4 41.6,24.7 v30.3,24.7
  Bottom 0.2: v30.3,24.7 30.4,24.8 30.4,26.79 IC1.16
N$1
  Bottom 0.2: SJ3.2 17.1,32 17.16,31.94 17.21,31.94 R14.1
N$2
  Bottom 0.2: C7.1 42.8,35.6
  Bottom 0.3: U$4.3 41,33.31 41,33.5 42.2,33.5 43,34.3 43,35.35 C7.1 | C7.1 43,35.5 | 42.95,35.6 C7.1 | SWITCH.2 38.1,34.2 38.5,34.6 38.6,34.7 41.9,34.7 42.8,35.6
N$3
  Bottom 0.2: C3.1 36,24.2 | 36,24.2 36,24.6 L1.1 | IC1.18 32.7,24.6 32.9,24.8 33.8,24.8 34.7,24.8 35.1,24.4 35.3,24.2 36,24.2
N$4
  Bottom 0.2: C4.2 33.9,24 33.9,23.9 33,23 IC1.20
N$5
  Bottom 0.6: Q5.P$3 40.2,39.5 39.9,39.8 PWR-1.P$1
N$7
  Bottom 0.2: IC1.7 23.1,24.6 22.4,24.6 22,24.2 19.2,24.2 19,24.4 C1.1 19,25.7 18.2,26.5 Q1.P$2
N$8
  Bottom 0.2: IC1.8 23.4,25.4 22.3,25.4 22,25.1 21.35,25.1 C2.2 21.3,25.6 22.4,26.7 Q1.P$1
N$9
  Bottom 0.6: Q4.P$3 35.7,43.7 35,44.4 32.2,44.4 31.8,44.4 PWR-2.2
N$11
  Bottom 0.2: SWITCH.1 35.58,33.02 35.6,33
  Bottom 0.3: 35.6,33 35.6,34.5 | 35.6,34.5 35.1,34.5 34.8,34.8 34.8,35.95 Q4.P$2 | 35.6,34.5 37.1,34.5 38.6,36 Q5.P$2
N$13
  Top 0.2: Q3.P$3 47,34.5 | PWR-3.2
  Top 0.6: 47,34.5 47,37.8 PWR-3.2
N$15
  Top 0.3: 32.7,39.4 32.71,39.21 OK6.5 32.7,39.3 32.7,38.3 32.3,37.9 28,37.9 27.63,38.27 OK6.7
  Top 0.406: 32.7,39.4 32.7,41.5 32.7,42.1 32.7,42.3 32,43 30.1,43 29.3,43.8 29.3,48.1 28.4,49 25.6,49 CAMERA.P$1
N$16
  Top 0.3: OK6.6 30.17,41.23 29.4,42 CAMERA.P$4
N$17
  Top 0.3: OK6.8 25.1,40 25.09,40.01 24.19,40.01 23.6,40.6 23.6,43.95 CAMERA.P$3 CAMERA.P$2
N$18  (via drill 0.5)
  Top 0.2: OK6.1 25.09,32.09 25.1,32.1 25.5,32.5 v25.8,32.5
  Bottom 0.2: R10.2 v25.8,32.5
N$19
  Bottom 0.2: MIC.1 10.9,33.7 R4.1
N$20
  Bottom 0.2: R5.1 C9.1 12.6,29.6 11.1,29.6 10.7,29.2 MIC.3
N$21
  Bottom 0.2: IC2.1 9.55,16.95 9.6,17 7.6,17 | 7.6,17 7.6,16.15 R7.1 | R8.2 7.6,18.2 7.6,17
N$22
  Bottom 0.2: C9.2 R6.1
N$23
  Bottom 0.2: R6.2 8.9,27.4 8.5,27 GAIN.P$2 9.3,20.5 9.5,20.3 IC2.3
N$24
  Bottom 0.2: IC2.4 12.11,18.81 12.1,18.8 13.4,18.8 | 13.4,18.8 13.4,20.6 | 13.4,20.6 GAIN.P$1 13.4,20.6 | 13.4,20.6 11,23 GAIN.CENTER | 13.4,18.8 13.6,18.6 R9.1
N$25
  Bottom 0.2: OK1.1 32.59,39.1 29.9,39.1 29.6,38.8 29.6,32.3 30.2,31.7 R12.2
N$26  (via drill 0.5)
  Top 0.2: OK6.3 30.17,29.77 30.2,29.9 30.2,32.2 29.9,32.5 v28,32.5
  Bottom 0.2: v28,32.5 R11.2
N$27  (via drill 0.4)
  Top 0.2: R13.1 21.35,40.5 v19,40.5
  Bottom 0.2: 17.6,39.6 Q2.C 17.5,40 18,40.5 v19,40.5
N$28
  Top 0.2: R13.2 21.5,46 21,46.5 IR.K
N$29
  Bottom 0.2: Q2.B 18.45,35.6 R21.2 18.5,35.35 18.5,34.5 18,34 17,34 R14.2
N$30
  Bottom 0.2: MODE1.AX 6.04,11.26 6.5,10.8 10,10.8 10.4,10.4 10.4,7.1 10.9,6.6 18.8,6.6 19.2,7 R15.2
N$31
  Bottom 0.2: R16.2 21.4,6.3 21.1,6 7.5,6 6.8,6.7 6.8,9.3 6.4,9.7 1.2,9.7 0.9,10 0.9,12.44 MODE1.AR
N$32
  Bottom 0.2: TRIGGER.AX 36.2,13 36.1,13.1 R17.2
N$33
  Bottom 0.2: R18.2 38.85,14.55 39.5,13.9 41.2,13.9 41.5,13.6 41.5,13.04 TRIGGER.AR
N$35
  Bottom 0.2: C12.1 44.45,19.05 44.4,19 44.4,21.54 UART.3
N$37
  Bottom 0.2: R19.2 16.9,11.7 16.1,12.5 MODE2.AX
N$38
  Bottom 0.2: R20.2 17.3,13.8 17.1,13.6 8.4,13.6 8,13.2 8,12.54 MODE2.AR
OUT_FLASH  (via drill 0.5)
  Top 0.2: JP1.4 44.45,25.65 44,25.2 31.1,25.2 30.9,25.4 v29.6,25.4
  Bottom 0.2: v29.6,25.4 IC1.15 29.6,27.6 30.2,28.2 R12.1
OUT_FOCUS
  Bottom 0.2: IC1.13 R11.1
OUT_IR  (via drill 0.5)
  Top 0.2: v29,28.1 27.5,28.1 26.5,29.1 26.4,29.2 26.4,32 26.8,32.4 26.8,33.1 26.4,33.5 24.7,33.5 24.5,33.5 22.8,31.8 v22.5,31.5
  Bottom 0.2: IC1.14 28.8,27.9 v29,28.1 | v22.5,31.5 20.5,31.5 SJ3.1
OUT_SHUTTER
  Bottom 0.2: IC1.12 27.2,27.4 25.8,28.8 R10.1
RESET  (via drill 0.5)
  Top 0.2: v45.4,22.9 30.9,22.9 30,22.9 29.7,22.6 29.7,20 29.4,19.7 R1.1 28.05,19.65 28,19.6 28,18 v27.2,17.2
  Bottom 0.2: v27.2,17.2 IC1.29 | JP1.5 46.99,23.29 46.6,22.9 | 46.6,22.9 v45.4,22.9 | 46.6,22.9 v45.4,22.9 | v45.4,22.9 45.7,22.9 45.7,20.2 46.1,19.8 46.1,19.15 C12.2
SCK  (via drill 0.5)
  Top 0.2: v39.8,25.9 39.4,25.9 32.2,25.9 v31.9,26.2
  Bottom 0.2: JP1.3 44.45,25.05 44.1,25.4 40.3,25.4 v39.8,25.9 | v31.9,26.2 IC1.17
UART_RX  (via drill 0.5)
  Top 0.2: v26.4,15.2 26.5,15.2 26.8,15.2 26.9,15.2 39.1,15.2 39.4,15.5 39.4,18.3 v39.4,18.6
  Bottom 0.2: v26.4,15.2 IC1.30 | v39.4,18.6 39.4,21.56 UART.1
UART_TX  (via drill 0.5)
  Top 0.2: v25.6,14.3 41.3,14.3 41.9,14.9 v41.9,15.9
  Bottom 0.2: IC1.31 v25.6,14.3 | v41.9,15.9 41.9,21 41.9,21.44 UART.2
UI_ARM
  Bottom 0.2: IC1.23 32.6,20.6 32.9,20.3 32.9,8.1 33.3,7.7 36.7,7.7 | 36.7,7.7 ARM.P$3 36.7,7.7 | ARM.P$4 36.7,1.3 36.7,7.7
UI_DELAY
  Bottom 0.2: SEL.P1-2 20.1,4.4 20.4,4.7 29.8,4.7 30.4,5.3 IC1.25
UI_MODE  (via drill 0.5)
  Top 0.2: MODE.P$4 13.2,7.7 v13.2,4.1
  Bottom 0.2: IC1.26 29.6,5.7 29.2,5.3 13.4,5.3 13.2,5.1 v13.2,4.1 13.2,1.3 MODE.P$3
UI_MODE_1.A
  Bottom 0.2: IC1.9 24.8,25.5 26.1,24.2 26.1,19.9 25.8,19.6 24.6,19.6 24,19 24,12.9 23.6,12.5 22.1,12.5 21.7,12.1 21.7,10.5 21.4,10.2 19.4,10.2 19.2,10 R15.1
UI_MODE_1.B
  Bottom 0.2: IC1.32 24.8,12.4 24.4,12 22.6,12 22.3,11.7 22.3,9.65 22.05,9.45 21.65,9.45 21.8,9.5 21.4,9.5 R16.1
UI_MODE_2.A
  Bottom 0.2: R19.1 20.4,11.7 20.7,12 20.8,12.1 21.7,13 22.9,13 23.3,13.4 IC1.1
UI_MODE_2.B
  Bottom 0.2: IC1.2 22.5,20.6 22.2,20.3 22.2,14.2 21.8,13.8 R20.1
UI_SCALE.A  (via drill 0.4, 0.5)
  Top 0.2: v30.5,22.2 36.2,22.2 37.1,22.2 v37.7,21.6
  Bottom 0.2: IC1.19 30.9,23.8 30.5,23.4 v30.5,22.2 | v37.7,21.6 38.2,21.1 38.2,18.7 38.2,18.6 40,16.8 40,16.5 40,15.5 40.5,15 42.7,15 42.9,15.2 42.9,16.4 43.1,16.6 45.6,16.6 45.8,16.4 45.8,15.8 | 45.8,15.8 45.8,15.2 45.8,12.9 46.1,12.6 46.9,11.8 46.9,11.4 JP2.4 | R2.2 46.8,15.8 45.8,15.8
UI_SCALE.B
  Bottom 0.2: IC1.22 36.9,21.4 37.3,21 37.3,18.8 39.4,16.7 39.4,16.4 39.4,14.8 39.8,14.4 42.6,14.4 42.75,14.25 | 42.75,14.25 42.9,14.1 42.9,11.7 43.2,11.4 JP2.3 | R3.2 44.25,15.75 43.5,15 42.75,14.25
UI_THRESH
  Bottom 0.2: IC1.24 31.89,4.99 SEL.P2-2
UI_TRIGGER.A  (via drill 0.4, 0.5)
  Top 0.2: v30.5,20.4 v35.6,20.4
  Bottom 0.2: v35.6,20.4 35.6,17.3 35.9,17 36.1,16.8 R17.1 | v30.5,20.4 27,20.4 26.7,20.7 26.7,24.5 25.6,25.6 IC1.10
UI_TRIGGER.B  (via drill 0.4, 0.5)
  Top 0.2: v30.5,21.3 35.9,21.3 36.1,21.3 36.3,21.3 36.6,21 v36.6,20.4
  Bottom 0.2: v36.6,20.4 36.6,18.1 36.8,17.9 37.2,17.5 37.7,17 37.9,16.8 37.9,16.6 38.1,16.6 38.2,16.5 R18.1 | v30.5,21.3 28,21.3 27.6,21.7 27.6,24.5 26.4,25.8 IC1.11

### Text on the board
_tsilk: CAMERA | FLASH | - | 6-12V | IR | + | 6-12V | - | 5V | + | LIGHT | PWR-SW | www.justgeek.de | FACT | MIC IN | ISP | Flash and / Camera / Trigger | v0.7 | - | TX | RX | 64 | ::1 :|2 / |:4 ||8 | SOUND | LIGHT | 0 | ms | 128 | factor | MODE | ARM | 1 | 0 | THRESHHOLD | DELAY
_bsilk: RING | TIP | IR | + | - | LIGHT | + | - | SOUND | fact v0.7 | www.justgeek.de